# EAGLE design LCD-OLINUXINO-4.3''TS_Rev_D1 (EAGLE 4.16)
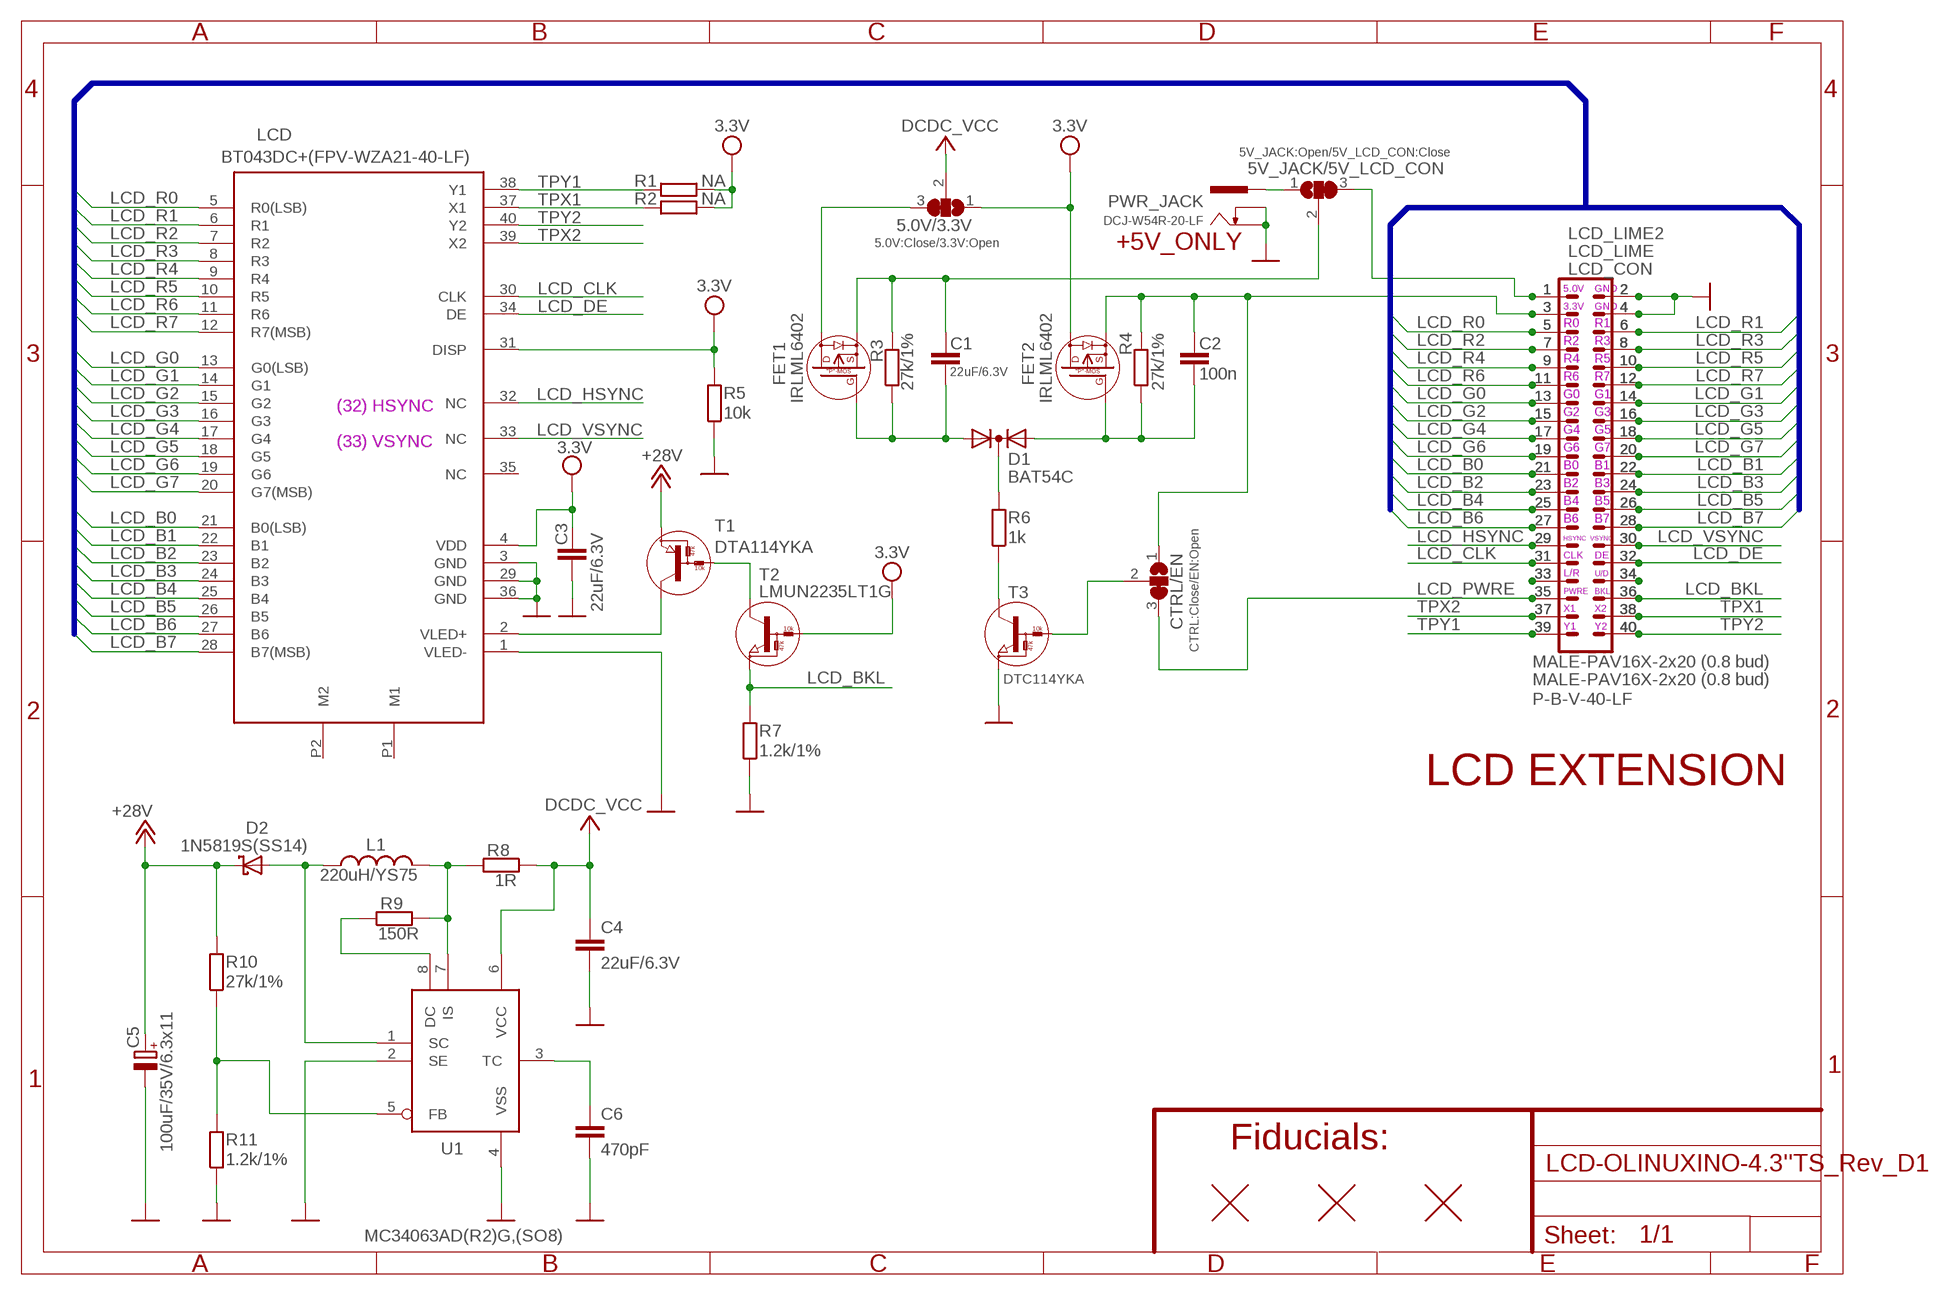
[diagram p0: schematic, sheet 1]

## Parts
5.0V/3.3V  5.0V:Close/3.3V:Open  SJ2W5  [SJ_2_SMALL_23_TIED]
5V_JACK/5V_LCD_CON  5V_JACK:Open/5V_LCD_CON:Close  SJ2W3  [SJ_2_SMALL]
C1  22uF/6.3V  C-EUC0603_DWS  [C0603_DWS]
C2  100n  C-EUC0603_DWS  [C0603_DWS]
C3  22uF/6.3V  C-EUC0603_DWS  [C0603_DWS]
C4  22uF/6.3V  C-EUC0603_DWS  [C0603_DWS]
C5  100uF/35V/6.3x11  CPOL-EUH1M  [CP6.3X11-H-M]
C6  470pF  C-EUC0603_DWS  [C0603_DWS]
CTRL/EN  CTRL:Close/EN:Open  SJ2W5  [SJ_2_SMALL_23_TIED]
D1  BAT54C  DIODE_AC-CA_  [SOT23C]
D2  1N5819S(SS14)  SCHOTKKY7.62SS2  [MLL-41]
FET1  IRLML6402  P-MOS+DIODIRLML6402  [SOT23]
FET2  IRLML6402  P-MOS+DIODIRLML6402  [SOT23]
L1  220uH/YS75  L-USL7078  [L7078]
LCD  BT043DC+(FPV-WZA21-40-LF)  GFT043A13-LCD4.3"  [FPV-WZA21-40-LF]
LCD_CON  P-B-V-40-LF  ML40-GBH-254-SMT-40  [ML40-MALE(GBH-254-SMT-40)]
LCD_LIME  MALE-PAV16X-2x20 (0.8 bud)  ML40YA-V36P-2X20-LF  [YA-V36P-2X20-LF]
LCD_LIME2  MALE-PAV16X-2x20 (0.8 bud)  ML40PA-V16X-2X20-LF_0.90_DRILL  [GPH127SMT-02X20(PA-V16X-2X20-LF)_DRILL_0.9MM]
PWR_JACK  DCJ-W54R-20-LF  PWR-JAKDCJ-W  [PWR-JACK-SMD]
R1  NA  R-EU_R0603_5MIL_DWS  [R0603_5MIL_DWS]
R2  NA  R-EU_R0603_5MIL_DWS  [R0603_5MIL_DWS]
R3  27k/1%  R-EU_R0603_5MIL_DWS  [R0603_5MIL_DWS]
R4  27k/1%  R-EU_R0603_5MIL_DWS  [R0603_5MIL_DWS]
R5  10k  R-EU_R0603_5MIL_DWS  [R0603_5MIL_DWS]
R6  1k  R-EU_R0603_5MIL_DWS  [R0603_5MIL_DWS]
R7  1.2k/1%  R-EU_R0603_5MIL_DWS  [R0603_5MIL_DWS]
R8  1R  R-EU_R0805_5MIL_DWS  [R0805_5MIL_DWS]
R9  150R  R-EU_R0603_5MIL_DWS  [R0603_5MIL_DWS]
R10  27k/1%  R-EU_R0603_5MIL_DWS  [R0603_5MIL_DWS]
R11  1.2k/1%  R-EU_R0603_5MIL_DWS  [R0603_5MIL_DWS]
T1  DTA114YKA  DIGITAL_TRANSISTORS-PNPDTA114YKA  [SOT-23]
T2  LMUN2235LT1G  DIGITAL_TRANSISTORS-NPNDTC114YKA  [SOT-23]
T3  DTC114YKA  DIGITAL_TRANSISTORS-NPNDTC114YKA  [SOT-23]
U1  MC34063AD(R2)G,(SO8)  MC34063A2  [SO-8]
U$1  FIDUCIAL  [FIDUCIAL-1X3]
U$2  FIDUCIAL  [FIDUCIAL-1X3]
U$3  FIDUCIAL  [FIDUCIAL-1X3]

## Nets
3.3VDC [pwr]: C2.1 CTRL/EN.1 FET2.2(S) LCD_CON.3 LCD_LIME2.3 LCD_LIME.3 R4.2
5VDC: 5V_JACK/5V_LCD_CON.2 C1.1 FET1.2(S) R3.2
+5V: 5.0V/3.3V.2 C4.1 R8.1 U1.6(VCC) ; supply symbol labelled DCDC_VCC
+12V: C5.+ D2.K(C) R10.2 T1.2(E) ; supply symbol labelled +28V
GND [pwr]: C3.2 C4.2 C5.- C6.2 LCD.1(VLED-) LCD.3(GND) LCD.29(GND) LCD.36(GND) LCD_CON.2 LCD_CON.4 LCD_LIME2.2 LCD_LIME2.4 LCD_LIME.2 LCD_LIME.4 PWR_JACK.2(-) PWR_JACK.3(--) R5.1 R7.1 R11.1 T3.2(E) U1.2(SE) U1.4(VSS)
LCD_B0: LCD.21(B0(LSB)) LCD_CON.21 LCD_LIME2.21 LCD_LIME.21
LCD_B1: LCD.22(B1) LCD_CON.22 LCD_LIME2.22 LCD_LIME.22
LCD_B2: LCD.23(B2) LCD_CON.23 LCD_LIME2.23 LCD_LIME.23
LCD_B3: LCD.24(B3) LCD_CON.24 LCD_LIME2.24 LCD_LIME.24
LCD_B4: LCD.25(B4) LCD_CON.25 LCD_LIME2.25 LCD_LIME.25
LCD_B5: LCD.26(B5) LCD_CON.26 LCD_LIME2.26 LCD_LIME.26
LCD_B6: LCD.27(B6) LCD_CON.27 LCD_LIME2.27 LCD_LIME.27
LCD_B7: LCD.28(B7(MSB)) LCD_CON.28 LCD_LIME2.28 LCD_LIME.28
LCD_BKL: LCD_CON.36 LCD_LIME2.36 LCD_LIME.36 R7.2 T2.2(E)
LCD_CLK: LCD.30(CLK) LCD_CON.31 LCD_LIME2.31 LCD_LIME.31
LCD_DE: LCD.34(DE) LCD_CON.32 LCD_LIME2.32 LCD_LIME.32
LCD_G0: LCD.13(G0(LSB)) LCD_CON.13 LCD_LIME2.13 LCD_LIME.13
LCD_G1: LCD.14(G1) LCD_CON.14 LCD_LIME2.14 LCD_LIME.14
LCD_G2: LCD.15(G2) LCD_CON.15 LCD_LIME2.15 LCD_LIME.15
LCD_G3: LCD.16(G3) LCD_CON.16 LCD_LIME2.16 LCD_LIME.16
LCD_G4: LCD.17(G4) LCD_CON.17 LCD_LIME2.17 LCD_LIME.17
LCD_G5: LCD.18(G5) LCD_CON.18 LCD_LIME2.18 LCD_LIME.18
LCD_G6: LCD.19(G6) LCD_CON.19 LCD_LIME2.19 LCD_LIME.19
LCD_G7: LCD.20(G7(MSB)) LCD_CON.20 LCD_LIME2.20 LCD_LIME.20
LCD_HSYNC: LCD.32(NC) LCD_CON.29 LCD_LIME2.29 LCD_LIME.29
LCD_PWRE: CTRL/EN.3 LCD_CON.35 LCD_LIME2.35 LCD_LIME.35
LCD_R0: LCD.5(R0(LSB)) LCD_CON.5 LCD_LIME2.5 LCD_LIME.5
LCD_R1: LCD.6(R1) LCD_CON.6 LCD_LIME2.6 LCD_LIME.6
LCD_R2: LCD.7(R2) LCD_CON.7 LCD_LIME2.7 LCD_LIME.7
LCD_R3: LCD.8(R3) LCD_CON.8 LCD_LIME2.8 LCD_LIME.8
LCD_R4: LCD.9(R4) LCD_CON.9 LCD_LIME2.9 LCD_LIME.9
LCD_R5: LCD.10(R5) LCD_CON.10 LCD_LIME2.10 LCD_LIME.10
LCD_R6: LCD.11(R6) LCD_CON.11 LCD_LIME2.11 LCD_LIME.11
LCD_R7: LCD.12(R7(MSB)) LCD_CON.12 LCD_LIME2.12 LCD_LIME.12
LCD_VSYNC: LCD.33(NC) LCD_CON.30 LCD_LIME2.30 LCD_LIME.30
N$1: 5.0V/3.3V.3 FET1.3(D)
N$2: T1.1(B) T2.3(C)
N$4: LCD_CON.33 LCD_LIME2.33 LCD_LIME.33
N$6: LCD_CON.34 LCD_LIME2.34 LCD_LIME.34
N$8: C2.2 D1.1(A1) FET2.1(G) R4.1
N$9: C1.2 D1.2(A2) FET1.1(G) R3.1
N$10: 5V_JACK/5V_LCD_CON.3 LCD_CON.1 LCD_LIME2.1 LCD_LIME.1
N$11: R6.1 T3.3(C)
N$16: CTRL/EN.2 T3.1(B)
N$19: D1.3(K) R6.2
N$22: 5V_JACK/5V_LCD_CON.1 PWR_JACK.1(+)
N$31: R10.1 R11.2 U1.5(FB)
N$64: C6.1 U1.3(TC)
N$65: D2.A L1.1 U1.1(SC)
N$74: L1.2 R8.2 R9.2 U1.7(IS)
N$81: R9.1 U1.8(DC)
TPX1: LCD.37(X1) LCD_CON.38 LCD_LIME2.38 LCD_LIME.38 R2.2
TPX2: LCD.39(X2) LCD_CON.37 LCD_LIME2.37 LCD_LIME.37
TPY1: LCD.38(Y1) LCD_CON.39 LCD_LIME2.39 LCD_LIME.39 R1.2
TPY2: LCD.40(Y2) LCD_CON.40 LCD_LIME2.40 LCD_LIME.40
VCC [pwr]: 5.0V/3.3V.1 C3.1 FET2.3(D) LCD.4(VDD) LCD.31(DISP) R1.1 R2.1 R5.2 T2.1(B) ; supply symbol labelled 3.3V
VLED+: LCD.2(VLED+) T1.3(C)
Unconnected: LCD.35(NC) LCD.P1(M1) LCD.P2(M2)

## Buses
LCD_R[0..7],LCD_G[0..7],LCD_B[0..7]

## Notes on the sheet
- +5V_ONLY
- 5.0V | GND
- 3.3V | GND
- R0 | R1
- R2 | R3
- R4 | R5
- R6 | R7
- G0 | G1
- (32) HSYNC
- G2 | G3
- G4 | G5
- (33) VSYNC
- G6 | G7
- B0 | B1
- B2 | B3
- B4 | B5
- B6 | B7
- HSYNC | VSYNC
- CLK | DE
- L/R | U/D
- PWRE | BKL
- X1 | X2
- Y1 | Y2
- LCD EXTENSION
- Fiducials:

## Library data of the parts
5.0V/3.3V 5V_JACK/5V_LCD_CON CTRL/EN = jumper:SJ2W: SMD solder JUMPER
C1-C4 C6 = rcl:C-EU: CAPACITOR, European symbol
C5 = rcl:CPOL-EU: POLARIZED CAPACITOR, European symbol
D1 = semicon-smd-ipc:DIODE_AC-CA_: DUAL DIODE
D2 = gogo:SCHOTKKY7.62SS
FET1 FET2 = Penko:P-MOS+DIOD
L1 = rcl:L-US: INDUCTOR, American symbol
LCD = olimex_lcd:GFT043: Construction: 4.3 inches a-Si color TFT-LCD, White LED / CCFL Backlight and PCB. Resolution (pixel): 480(R.G.B) X272 Number of the Colors : 262K colors ( R , G , B 6 bit digital each) LCD type : Transmissive Color TFT LCD ( normally White) Interface: 40 pin pitch 0.5 FFC Power Supply Voltage: 3.3V single power input. Built-in power supply circuit. Viewing Direction:6 O`clock (The direction it`s hard to be discolored )
LCD_CON LCD_LIME LCD_LIME2 = con-harting-ml:ML40: HARTING
PWR_JACK = gogo:PWR-JAK
R1-R11 = rcl:R-EU_: RESISTOR, European symbol
T1 = OLIMEX_DISCRET:DIGITAL_TRANSISTORS-PNP: DTA114YKA Digital Transistor - PNP
T2 T3 = OLIMEX_DISCRET:DIGITAL_TRANSISTORS-NPN: DTC114YKA Digital Transistor - NPN
U1 = MPLAB_ICD2:MC34063A
U$1-U$3 = SparkFunEagle-6-6-07:FIDUCIAL: Fiducial Alignment Points Various fiducial points for machine vision alignment.

## Board
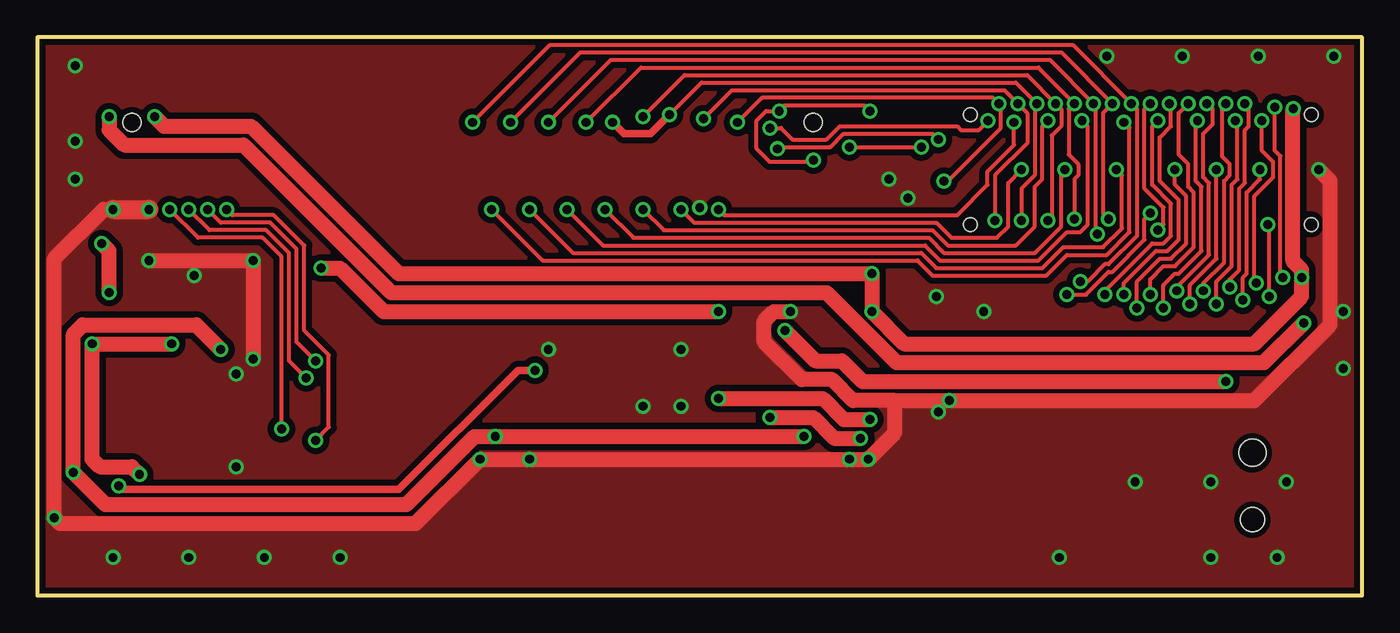
[diagram p1: board, top side]
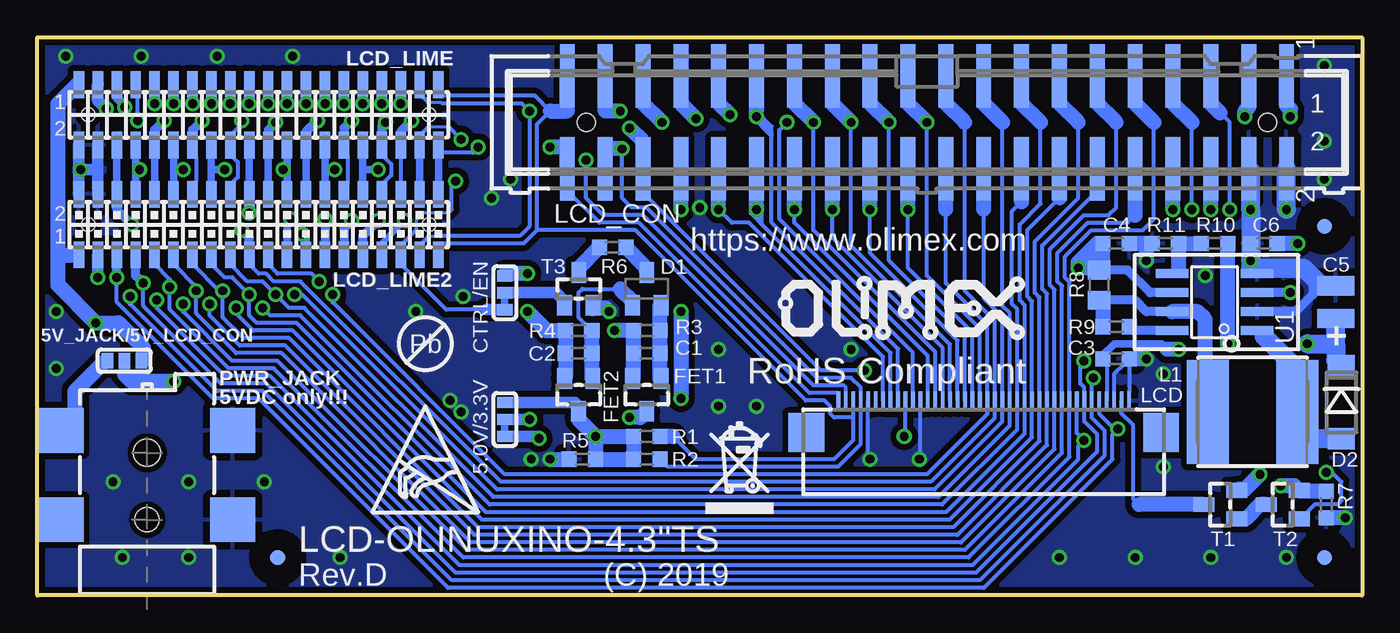
[diagram p2: board, bottom side, seen from below]

Size 88.9 x 37.47 mm. Coordinates in mm from the lower left corner, seen from the top.
Outline: 0,37.47 0,0 88.9,0 88.9,37.47 0,37.47
Copper layers (1*16): Top 0.035mm / dielectric 1.5mm / Bottom 0.035mm
Design rules "default": minimum track width 8mil, minimum drill 0.6mm, track to track 8mil, track to pad 8mil, pad to pad 8mil, via to via 8mil, smd to smd 1mil, copper to edge 10mil, drill to drill 12mil, minimum pad ring 8mil, minimum via ring 8mil, stop-mask expansion 2mil, vias tented up to drill 25mil, thermal gap 20mil

### Footprints (pad centres in the part's own frame; a part is rotated, then mirrored left to right if it is on the bottom)
SJ_2_SMALL_23_TIED = smd 0.762 x 1.016: 1 -1.143,0; 2 0,0; 3 1.143,0
SJ_2_SMALL = smd 0.762 x 1.016: 1 -1.143,0; 2 0,0; 3 1.143,0
C0603_DWS = smd 1.016 x 1.016: 1 -0.889,0; 2 0.889,0
CP6.3X11-H-M = smd 2.5 x 1.3: + 0,-1.1; - 0,1.1
SOT23C = smd 1.4 x 1: 1 1.1,-0.95; 2 1.1,0.95; 3 -1.1,0
MLL-41 = smd 1.45 x 1.8: A 2.445,0; K -2.445,0
SOT23 = smd 1.4 x 1: 1 1.1,-0.95; 2 1.1,0.95; 3 -1.1,0
L7078 = smd 2.8 x 7: 1 -3,0; 2 3,0
FPV-WZA21-40-LF = smd 0.25 x 1.3: 1 -9.8,-0.85; 2 -9.3,-0.85; 3 -8.8,-0.85; 4 -8.3,-0.85; 5 -7.8,-0.85; 6 -7.3,-0.85; 7 -6.8,-0.85; 8 -6.3,-0.85; 9 -5.8,-0.85; 10 -5.3,-0.85; 11 -4.8,-0.85; 12 -4.3,-0.85; 13 -3.8,-0.85; 14 -3.3,-0.85; 15 -2.8,-0.85; 16 -2.3,-0.85; 17 -1.8,-0.85; 18 -1.3,-0.85; 19 -0.8,-0.85; 20 -0.3,-0.85; 21 0.2,-0.85; 22 0.7,-0.85; 23 1.2,-0.85; 24 1.7,-0.85; 25 2.2,-0.85; 26 2.7,-0.85; 27 3.2,-0.85; 28 3.7,-0.85; 29 4.2,-0.85; 30 4.7,-0.85; 31 5.2,-0.85; 32 5.7,-0.85; 33 6.2,-0.85; 34 6.7,-0.85; 35 7.2,-0.85; 36 7.7,-0.85; 37 8.2,-0.85; 38 8.7,-0.85; 39 9.2,-0.85; 40 9.7,-0.85 | smd 2.4 x 2.6: P1 -11.95,1.25; P2 11.85,1.25
ML40-MALE(GBH-254-SMT-40) = smd 1 x 4.25: 1 -24.13,-3.125; 2 -24.13,3.125; 3 -21.59,-3.125; 4 -21.59,3.125; 5 -19.05,-3.125; 6 -19.05,3.125; 7 -16.51,-3.125; 8 -16.51,3.125; 9 -13.97,-3.125; 10 -13.97,3.125; 11 -11.43,-3.125; 12 -11.43,3.125; 13 -8.89,-3.125; 14 -8.89,3.125; 15 -6.35,-3.125; 16 -6.35,3.125; 17 -3.81,-3.125; 18 -3.81,3.125; 19 -1.27,-3.125; 20 -1.27,3.125; 21 1.27,-3.125; 22 1.27,3.125; 23 3.81,-3.125; 24 3.81,3.125; 25 6.35,-3.125; 26 6.35,3.125; 27 8.89,-3.125; 28 8.89,3.125; 29 11.43,-3.125; 30 11.43,3.125; 31 13.97,-3.125; 32 13.97,3.125; 33 16.51,-3.125; 34 16.51,3.125; 35 19.05,-3.125; 36 19.05,3.125; 37 21.59,-3.125; 38 21.59,3.125; 39 24.13,-3.125; 40 24.13,3.125 | hole 1.2: -22.86,0; 22.86,0
YA-V36P-2X20-LF_0.9DRILL = smd 0.7 x 1.8: 1 -12.065,2.032; 2 -12.065,-2.032; 3 -10.795,2.032; 4 -10.795,-2.032; 5 -9.525,2.032; 6 -9.525,-2.032; 7 -8.255,2.032; 8 -8.255,-2.032; 9 -6.985,2.032; 10 -6.985,-2.032; 11 -5.715,2.032; 12 -5.715,-2.032; 13 -4.445,2.032; 14 -4.445,-2.032; 15 -3.175,2.032; 16 -3.175,-2.032; 17 -1.905,2.032; 18 -1.905,-2.032; 19 -0.635,2.032; 20 -0.635,-2.032; 21 0.635,2.032; 22 0.635,-2.032; 23 1.905,2.032; 24 1.905,-2.032; 25 3.175,2.032; 26 3.175,-2.032; 27 4.445,2.032; 28 4.445,-2.032; 29 5.715,2.032; 30 5.715,-2.032; 31 6.985,2.032; 32 6.985,-2.032; 33 8.255,2.032; 34 8.255,-2.032; 35 9.525,2.032; 36 9.525,-2.032; 37 10.795,2.032; 38 10.795,-2.032; 39 12.065,2.032; 40 12.065,-2.032 | hole 0.9: -11.43,0; 11.43,0
GPH127SMT-02X20(PA-V16X-2X20-LF)_DRILL_0.9MM = smd 0.7 x 1.8: 1 -12.065,-2.032; 2 -12.065,2.032; 3 -10.795,-2.032; 4 -10.795,2.032; 5 -9.525,-2.032; 6 -9.525,2.032; 7 -8.255,-2.032; 8 -8.255,2.032; 9 -6.985,-2.032; 10 -6.985,2.032; 11 -5.715,-2.032; 12 -5.715,2.032; 13 -4.445,-2.032; 14 -4.445,2.032; 15 -3.175,-2.032; 16 -3.175,2.032; 17 -1.905,-2.032; 18 -1.905,2.032; 19 -0.635,-2.032; 20 -0.635,2.032; 21 0.635,-2.032; 22 0.635,2.032; 23 1.905,-2.032; 24 1.905,2.032; 25 3.175,-2.032; 26 3.175,2.032; 27 4.445,-2.032; 28 4.445,2.032; 29 5.715,-2.032; 30 5.715,2.032; 31 6.985,-2.032; 32 6.985,2.032; 33 8.255,-2.032; 34 8.255,2.032; 35 9.525,-2.032; 36 9.525,2.032; 37 10.795,-2.032; 38 10.795,2.032; 39 12.065,-2.032; 40 12.065,2.032 | hole 0.9: -11.43,0; 11.43,0
PWR-JACK-SMD = smd 3 x 3: 1 6,5.75; 2 0,-5.75; 3 6,-5.75; 4 0,5.75 | hole 1.6: 0,0 | hole 1.8: 4.5,0
R0603_5MIL_DWS = smd 1.016 x 1.016: 1 -0.889,0; 2 0.889,0
R0805_5MIL_DWS = smd 1.27 x 1.524: 1 -1.016,0; 2 1.016,0
SOT-23 = smd 1.4 x 1: 1 1.1,-0.95; 2 1.1,0.95; 3 -1.1,0
SO-8 = smd 0.6 x 2.2: 1 -1.905,-2.854; 2 -0.635,-2.854; 3 0.635,-2.854; 4 1.905,-2.854; 5 1.905,2.854; 6 0.635,2.854; 7 -0.635,2.854; 8 -1.905,2.854
FIDUCIAL-1X3 = smd 1 x 1: 1 0,0

### Placement (x,y rotation side)
5.0V/3.3V  57.53,11.81 270 bottom
5V_JACK/5V_LCD_CON  83.06,15.75 0 bottom
C1  48.01,16.26 0 bottom
C2  52.58,16.26 0 bottom
C3  16.51,15.88 0 bottom
C4  16.51,23.62 0 bottom
C5  1.78,19.68 0 bottom
C6  6.6,23.62 180 bottom
CTRL/EN  57.53,20.32 270 bottom
D1  48.01,20.57 270 bottom
D2  1.4,12.95 270 bottom
FET1  48.01,13.46 90 bottom
FET2  52.58,13.46 90 bottom
L1  7.37,12.32 180 bottom
LCD  25.45,12.19 180 bottom
LCD_CON  29.21,31.75 180 bottom
LCD_LIME  MALE-PAV16X-2x20 (0.8 bud)  [YA-V36P-2X20-LF_0.9DRILL]  74.04,32.26 0 bottom
LCD_LIME2  74.04,24.89 0 bottom
PWR_JACK  81.53,5.08 90 bottom
R1  48.01,10.67 0 bottom
R2  48.01,9.14 0 bottom
R3  48.01,17.78 180 bottom
R4  52.58,17.78 180 bottom
R5  52.32,9.14 0 bottom
R6  50.29,23.37 0 bottom
R7  2.41,6.1 90 bottom
R8  17.65,20.83 270 bottom
R9  16.51,18.03 180 bottom
R10  9.91,23.62 0 bottom
R11  13.21,23.62 0 bottom
T1  9.53,6.1 0 bottom
T2  5.33,6.1 0 bottom
T3  52.56,20.57 270 bottom
U1  9.91,19.68 90 bottom
U$1  72.77,2.54 270 bottom
U$2  2.54,24.77 270 bottom
U$3  2.54,2.54 270 bottom
U$4  [PB_SMALL]  62.87,16.89 0 bottom
U$8  [OLIMEX1_V]  21.46,17.02 0 bottom
U$10  [ESD_SYMBOL]  66.42,5.59 0 bottom
U$11  [RECYCLE_BIN1/8]  44.07,5.46 0 bottom

### Tracks (layer width: path | path; a pad name or v marks a point on that pad's centre or on a via)
3.3VDC  (via drill 0.6)
  Top 0.813: 84.25,32.64 v84.28,32.66
  Top 1.016: v7.87,32.13 8.51,31.5 14.35,31.5 24.26,21.59 v56.01,21.59 v56.01,19.05 58.17,16.89 81.66,16.89 84.84,20.07 v84.84,21.34 84.84,21.84 84.25,22.43 84.25,32.64
  Bottom 0.762: 57.53,21.59 CTRL/EN.1 | v84.84,21.34 LCD_LIME2.3
  Bottom 0.813: v84.28,32.66 84.84,33.22 LCD_LIME.3
  Bottom 1.016: FET2.2 53.47,14.62 C2.1 R4.2 54.74,17.78 v56.01,19.05 | v56.01,21.59 57.53,21.59 | 7.62,35.56 LCD_CON.3 7.62,32.77 7.87,32.51 v7.87,32.13
5VDC  (via drill 0.6)
  Top 1.016: v50.16,17.78 52.2,15.75 53.98,15.75 55.37,14.35 v79.76,14.35
  Bottom 0.762: 83.06,14.86 5V_JACK/5V_LCD_CON.2
  Bottom 1.016: FET1.2 48.9,14.56 C1.1 R3.2 v50.16,17.78 | v79.76,14.35 82.55,14.35 83.06,14.86
+5V  (via drill 0.6)
  Top 1.016: v19.05,21.97 20.32,21.97 23.24,19.05 v45.72,19.05 | v45.72,13.21 52.7,13.21 54.1,11.81 v55.88,11.81
  Bottom 0.61: U1.6 14.22,20.32 15.75,21.84 17.4,21.84
  Bottom 0.762: v55.88,11.81 5.0V/3.3V.2
  Bottom 1.016: 17.4,21.84 R8.1 | 17.4,21.84 C4.1 17.78,23.62 19.05,22.35 v19.05,21.97 | 17.4,21.84 17.4,21.97 v19.05,21.97 | v45.72,19.05 v45.72,13.21 | v19.05,21.97 17.78,23.24
+12V  (via drill 0.6)
  Top 1.016: v6.86,8.13 6.35,8.64 4.19,8.64 3.68,9.14 v3.68,16.89 v9.02,16.89
  Bottom 1.016: v9.02,16.89 R10.2 | T1.2 8.43,7.07 8.38,7.11 7.87,7.11 v6.86,8.13
  Bottom 1.27: D2.K 1.78,15.78 1.78,16.89 | v3.68,16.89 1.78,16.89 | 1.78,16.89 C5.+
GND  (via drill 0.6)
  Top 1.016: v7.49,22.48 v14.48,22.48 v14.48,15.88 | v5.08,25.91 4.45,25.91 1.14,22.61 v1.14,5.21 1.52,4.83 25.4,4.83 v29.72,9.14 v33.02,9.14 v54.48,9.14 v55.75,9.14 57.53,10.92 57.53,13.08 | v50.55,19.05 49.4,19.05 48.77,18.41 48.77,17.02 51.31,14.48 53.34,14.48 54.74,13.08 57.53,13.08 | 57.53,13.08 81.66,13.08 86.74,18.16 86.74,27.81 v85.98,28.57
  Top 1.27: v5.08,25.91 v7.49,25.91
  Bottom 0.254: 15.62,15.49 15.62,13.72 15.65,13.69 LCD.1 | C3.2 15.62,15.49 | 15.62,15.49 16,15.49 16.65,14.85 LCD.3 | v29.72,9.14 29.65,9.21 LCD.29 | v33.02,9.14 33.15,9.27 LCD.36
  Bottom 0.508: 7.05,21.97 U1.4
  Bottom 0.61: U1.2 4.45,19.05 3.3,20.19 3.3,20.95 2.92,20.95
  Bottom 0.762: 7.49,28.5 LCD_CON.4 | 84.84,28.57 LCD_LIME2.4 | 84.84,28.57 LCD_LIME.4 | 86.11,28.57 LCD_LIME2.2 | 86.11,28.57 v85.98,28.57 84.84,28.57 | 86.11,28.57 LCD_LIME.2
  Bottom 1.016: 14.48,23.62 R11.1 | 14.48,23.62 C4.2 | v1.14,5.21 R7.1 | v54.48,9.14 R5.1 | v14.48,22.48 14.48,23.62 | v14.48,15.88 C3.2 | v50.55,19.05 50.8,19.3 51.61,19.3 T3.2
  Bottom 1.27: C5.- 2.75,20.79 2.92,20.95 3.94,21.97 7.05,21.97 7.49,21.97 v7.49,22.48 C6.2 v7.49,25.91 7.49,28.5 | v5.08,25.91 LCD_CON.2
  other vias: 5.08,2.54 10.16,2.54 15.24,2.54 20.32,2.54 68.58,2.54 78.74,2.54 83.19,2.54 83.82,7.62 78.74,7.62 73.66,7.62 2.54,35.56 2.54,30.48 87,36.2 81.92,36.2 76.83,36.2 71.75,36.2 63.5,19.05 57.15,27.94 58.42,26.67 2.54,27.94 13.34,8.64 13.34,14.86 40.64,12.7 43.18,12.7 43.18,16.51 34.29,16.51 44.45,26.04 60.33,20.07 10.54,21.46 87.63,15.24 87.63,19.05 61.21,13.08 60.45,12.32
  pour Top (isolate 0.406, rank 2): -5.08,42.55 -5.08,-5.08 93.98,-5.08 93.98,42.55
  pour Bottom (isolate 0.406, rank 3): -2.54,-2.54 91.44,-2.54 91.44,40.01 -2.54,40.01
LCD_B0  (via drill 0.6)
  Top 0.254: v29.21,31.75 34.42,36.96 69.47,36.96 v73.41,33.02 73.79,32.64 73.79,24.13 71.88,22.23 71.63,22.23 70.48,21.08 v69.98,21.08
  Bottom 0.254: LCD.21 25.65,17.9 29.21,21.46 v29.21,31.75 | LCD_LIME2.21 73.41,22.23 72.77,21.59 70.48,21.59 v69.98,21.08
  Bottom 0.406: v73.41,33.02 LCD_LIME.21
  Bottom 1.016: LCD_CON.21 30.48,33.02 v29.21,31.75
LCD_B1  (via drill 0.6)
  Top 0.254: v30.48,25.91 33.91,22.48 59.05,22.48 60.07,21.46 67.69,21.46 69.09,22.86 71.75,22.86 73.28,24.38 73.28,31.37 v72.9,31.75
  Bottom 0.254: LCD.22 26.15,17.64 30.48,21.97 v30.48,25.91
  Bottom 0.508: LCD_LIME.22 LCD_LIME2.22
  Bottom 0.61: LCD_LIME.22 73.41,31.24 v72.9,31.75
  Bottom 1.016: v30.48,25.91 LCD_CON.22
LCD_B2  (via drill 0.6)
  Top 0.254: v31.75,31.75 36.45,36.45 68.71,36.45 v72.14,33.02 71.5,32.38 71.5,25.65 v71.88,25.27
  Bottom 0.254: LCD.23 26.65,17.38 31.75,22.48 v31.75,31.75
  Bottom 0.406: v72.14,33.02 LCD_LIME.23
  Bottom 0.508: LCD_LIME2.23 72.14,25.02 v71.88,25.27
  Bottom 1.016: LCD_CON.23 33.02,33.02 v31.75,31.75
LCD_B3  (via drill 0.6)
  Top 0.254: v33.02,25.91 35.94,22.99 59.31,22.99 60.33,21.97 67.44,21.97 68.83,23.37 71.5,23.37 72.77,24.64 72.77,28.19 v72.39,28.57
  Bottom 0.254: LCD.24 27.15,17.12 33.02,22.99 v33.02,25.91 | v72.39,28.57 72.14,28.57
  Bottom 0.508: LCD_LIME.24 72.14,28.57 LCD_LIME2.24
  Bottom 1.016: v33.02,25.91 LCD_CON.24
LCD_B4  (via drill 0.6)
  Top 0.254: v34.29,31.75 38.48,35.94 67.94,35.94 v70.87,33.02 70.99,32.89 70.99,24.38 v71.12,24.26
  Bottom 0.254: LCD.25 27.65,16.85 34.29,23.5 v34.29,31.75
  Bottom 0.406: v70.87,33.02 LCD_LIME.25
  Bottom 0.508: v71.12,24.26 70.87,24 LCD_LIME2.25
  Bottom 1.016: LCD_CON.25 35.56,33.02 v34.29,31.75
LCD_B5  (via drill 0.6)
  Top 0.254: v35.56,25.91 37.97,23.5 59.56,23.5 60.58,22.48 67.18,22.48 69.09,24.38 69.98,24.38 70.48,24.89 70.48,31.5 v70.1,31.88
  Bottom 0.254: LCD.26 28.15,16.59 35.56,24 v35.56,25.91
  Bottom 0.508: LCD_LIME.26 LCD_LIME2.26
  Bottom 0.61: v70.1,31.88 70.87,31.11 LCD_LIME.26
  Bottom 1.016: 35.56,28.7 LCD_CON.26 v35.56,25.91
LCD_B6  (via drill 0.6)
  Top 0.254: v36.83,31.75 40.51,35.43 67.18,35.43 v69.6,33.02 69.22,32.64 69.22,29.59 69.85,28.96 69.85,28.19 69.6,27.94 v69.6,25.27
  Bottom 0.254: LCD.27 28.65,16.33 36.83,24.51 v36.83,31.75
  Bottom 0.406: v69.6,33.02 LCD_LIME.27
  Bottom 0.61: v69.6,25.27 LCD_LIME2.27
  Bottom 1.016: LCD_CON.27 38.1,33.02 v36.83,31.75
LCD_B7  (via drill 0.6)
  Top 0.254: v38.1,25.91 40.01,24 59.82,24 60.83,22.99 66.93,22.99 68.71,24.77 68.71,28.32 v68.96,28.57
  Bottom 0.254: LCD.28 29.15,16.07 38.1,25.02 v38.1,25.91 | 69.47,28.57 69.6,28.57
  Bottom 0.508: LCD_LIME.28 69.6,28.57 LCD_LIME2.28 | v68.96,28.57 69.47,28.57
  Bottom 1.016: 38.1,28.7 LCD_CON.28 v38.1,25.91
LCD_BKL  (via drill 0.6)
  Top 0.254: v49.15,31.37 49.91,31.37 50.67,30.61 52.96,30.61 53.85,31.5 61.72,31.5 61.98,31.24 63.17,31.24 v63.78,31.85
  Top 0.508: v5.46,7.37 5.71,7.11 24.26,7.11 32.26,15.11 v33.4,15.11
  Bottom 0.254: v33.4,15.11 36.32,15.11 48.26,27.05 LCD_CON.36 | LCD_LIME.36 LCD_LIME2.36
  Bottom 0.61: LCD_LIME.36 64.52,31.11 v63.78,31.85
  Bottom 1.016: R7.2 4.17,6.99 T2.2 4.55,7.37 v5.46,7.37 | LCD_CON.36 48.26,30.48 v49.15,31.37
LCD_CLK  (via drill 0.6)
  Top 0.254: v42.42,32.26 44.58,34.42 65.66,34.42 v67.06,33.02 66.93,32.89 66.93,28.19 66.04,27.3 v66.04,25.15
  Top 0.508: v42.42,32.26 41.15,30.99 40.64,30.99 39.37,30.99 v38.61,31.75
  Bottom 0.254: LCD.30 30.15,16.31 39.12,25.27 39.12,31.24 v38.61,31.75
  Bottom 0.406: v67.06,33.02 LCD_LIME.31
  Bottom 0.61: v66.04,25.15 67.06,24.13 LCD_LIME2.31
  Bottom 1.016: LCD_CON.31 43.18,33.02 v42.42,32.26
LCD_DE  (via drill 0.6)
  Top 0.254: v43.18,25.91 44.07,25.02 60.33,25.02 61.34,24 64.39,24 65.15,24.77 65.15,27.69 v66.04,28.57
  Bottom 0.254: LCD.34 32.15,16.02 41.15,25.02 42.29,25.02 v43.18,25.91
  Bottom 0.508: 67.06,28.57 LCD_LIME2.32 | 67.06,28.57 LCD_LIME.32 | v66.04,28.57 67.06,28.57
  Bottom 1.016: v43.18,25.91 LCD_CON.32
LCD_G0  (via drill 0.6)
  Top 0.254: v76.45,20.45 76.45,20.7 78.61,22.86 78.61,27.69 78.23,28.07 78.23,30.99 78.87,31.62 78.87,32.64 v78.49,33.02
  Bottom 0.254: 19.05,31.75 19.05,26.67 21.97,23.75 21.97,20.32 21.65,20 LCD.13 21.65,10.36 27.43,4.57 59.31,4.57 72.01,17.27 75.06,17.27 76.45,18.67 v76.45,20.45 76.71,20.45 78.49,22.23 LCD_LIME2.13
  Bottom 0.406: v78.49,33.02 LCD_LIME.13
  Bottom 1.016: LCD_CON.13 20.32,33.02 19.05,31.75
LCD_G1  (via drill 0.6)
  Top 0.254: v75.56,19.3 75.56,20.83 76.33,21.59 76.58,21.59 78.11,23.11 78.11,27.43 77.72,27.81 77.72,31.75 v77.85,31.88
  Bottom 0.254: 20.32,26.67 22.48,24.51 22.48,20.07 22.15,19.74 LCD.14 22.15,10.62 27.69,5.08 59.05,5.08 71.75,17.78 74.42,17.78 75.56,18.92 v75.56,19.3 | LCD_LIME.14 78.49,29.59 78.23,29.34 78.23,27.81 78.49,27.56 LCD_LIME2.14
  Bottom 0.61: v77.85,31.88 78.49,31.24 LCD_LIME.14
  Bottom 1.016: 20.32,26.67 LCD_CON.14
LCD_G2  (via drill 0.6)
  Top 0.254: v74.68,20.19 74.68,21.21 75.56,22.1 76.33,22.1 77.6,23.37 77.6,27.05 77.22,27.43 77.22,28.96 76.58,29.59 76.58,32.38 v77.22,33.02
  Bottom 0.254: 21.59,31.75 21.59,26.29 22.99,24.89 22.99,19.81 22.65,19.47 LCD.15 22.65,10.88 27.94,5.59 58.8,5.59 71.5,18.29 74.17,18.29 74.68,18.8 v74.68,20.19 75.82,21.34 76.33,21.34 77.22,22.23 LCD_LIME2.15
  Bottom 0.406: v77.22,33.02 LCD_LIME.15
  Bottom 1.016: LCD_CON.15 22.86,33.02 21.59,31.75
LCD_G3  (via drill 0.6)
  Top 0.254: v73.79,19.3 73.79,21.08 75.31,22.61 76.07,22.61 77.09,23.62 77.09,26.8 76.33,27.56 v76.33,28.57
  Bottom 0.254: 22.86,26.42 23.5,25.78 23.5,19.56 23.15,19.21 LCD.16 23.15,11.14 28.19,6.1 58.55,6.1 71.25,18.8 73.28,18.8 v73.79,19.3
  Bottom 0.508: 77.22,28.57 LCD_LIME2.16 | 77.22,28.57 LCD_LIME.16 | v76.33,28.57 77.22,28.57
  Bottom 1.016: 22.86,26.42 LCD_CON.16
LCD_G4  (via drill 0.6)
  Top 0.254: v72.9,20.19 72.9,20.95 75.06,23.11 75.82,23.11 76.58,23.88 76.58,26.54 75.31,27.81 75.31,30.73 76.07,31.5 76.07,32.89 v75.95,33.02
  Bottom 0.254: 24.13,31.75 24.13,19.43 23.65,18.95 LCD.17 23.65,11.4 28.45,6.6 58.29,6.6 70.99,19.3 72.01,19.3 v72.9,20.19 73.79,21.08 74.8,21.08 75.95,22.23 LCD_LIME2.17
  Bottom 0.406: v75.95,33.02 LCD_LIME.17
  Bottom 1.016: 24.13,31.75 25.4,33.02 LCD_CON.17
LCD_G5  (via drill 0.6)
  Top 0.254: v71.63,20.19 71.63,20.45 74.8,23.62 75.56,23.62 76.07,24.13 76.07,26.29 74.8,27.56 74.8,31.5 v75.18,31.88
  Bottom 0.254: 25.4,25.91 25.4,19.94 24.15,18.69 LCD.18 24.15,11.66 28.7,7.11 58.04,7.11 71.12,20.19 v71.63,20.19 | LCD_LIME2.18 75.95,27.56 75.44,28.07 75.44,29.08 75.95,29.59 LCD_LIME.18 75.95,30.86 75.18,31.62 v75.18,31.88
  Bottom 1.016: 25.4,25.91 LCD_CON.18
LCD_G6  (via drill 0.6)
  Top 0.254: v75.18,24.51 75.56,24.89 75.56,26.04 74.3,27.3 74.3,32.64 v74.68,33.02
  Bottom 0.254: 26.67,31.75 26.67,20.45 24.65,18.43 LCD.19 24.65,11.93 28.96,7.62 57.78,7.62 71.25,21.08 73.03,21.08 73.53,21.59 74.04,21.59 74.68,22.23 LCD_LIME2.19
  Bottom 0.406: v74.68,33.02 LCD_LIME.19
  Bottom 0.61: LCD_LIME2.19 74.68,24 v75.18,24.51
  Bottom 1.016: LCD_CON.19 27.94,33.02 26.67,31.75
LCD_G7  (via drill 0.6)
  Top 0.254: v69.09,20.19 70.36,20.19 71.88,21.72 72.14,21.72 74.3,23.88 74.3,25.27 v74.68,25.65
  Bottom 0.254: 27.94,25.91 27.94,20.95 25.15,18.16 LCD.20 25.15,12.19 29.21,8.13 57.53,8.13 69.09,19.68 v69.09,20.19
  Bottom 0.508: LCD_LIME2.20 LCD_LIME.20
  Bottom 0.61: v74.68,25.65 LCD_LIME2.20
  Bottom 1.016: 27.94,25.91 LCD_CON.20
LCD_HSYNC  (via drill 0.6)
  Top 0.254: v40.64,32.13 43.43,34.92 66.42,34.92 v68.33,33.02 68.71,32.64 68.71,31.5 68.07,30.86 68.07,25.4 v67.82,25.15
  Bottom 0.254: LCD.32 31.15,16.54 39.62,25.02 39.62,30.84 | 39.62,30.84 39.62,30.96 | 39.62,30.96 39.62,31.11 | 39.62,31.11 39.62,31.47 40.64,32.49 40.64,32.61 | 39.62,31.11 v40.64,32.13 | 39.62,30.96 40.64,31.98 40.64,32.11 | 39.62,30.84 40.89,32.11
  Bottom 0.406: v68.33,33.02 LCD_LIME.29
  Bottom 0.61: v67.82,25.15 68.33,24.64 LCD_LIME2.29
  Bottom 1.016: v40.64,32.13 40.64,32.61 LCD_CON.29
LCD_PWRE  (via drill 0.6)
  Top 0.254: v46.99,31.75 48.64,33.4 64.14,33.4 v64.52,33.02 64.64,32.89 64.64,31.37 61.09,27.81 v60.83,27.81
  Bottom 0.203: 63.45,24.56 63.45,25.2 62.94,25.7 61.29,25.7
  Bottom 0.254: 58.8,19.18 61.47,19.18 64.52,22.23 LCD_LIME2.35 64.52,23.5 63.45,24.56 | 61.29,25.7 61.09,25.91 61.09,27.56 v60.83,27.81
  Bottom 0.406: v64.52,33.02 LCD_LIME.35
  Bottom 0.762: CTRL/EN.3 58.8,19.18
  Bottom 1.016: LCD_CON.35 48.26,33.02 v46.99,31.75
LCD_R0  (via drill 0.6)
  Top 0.254: v8.89,25.91 10.79,24 15.11,24 16.38,22.73 v16.38,11.18 | v83.57,21.34 83.41,21.49 83.41,29.49 83.03,29.87 v83.03,32.77
  Bottom 0.254: v8.89,25.91 8.89,31.75 9.53,32.38 | LCD.5 17.65,12.19 16.64,11.18 v16.38,11.18 16.76,10.79 16.76,9.14 25.4,0.51 61.34,0.51 74.04,13.21 77.09,13.21 83.57,19.68 v83.57,21.34
  Bottom 0.61: v83.57,21.34 LCD_LIME2.5 | v83.03,32.77 83.03,32.87 83.57,33.4 LCD_LIME.5
  Bottom 1.016: LCD_CON.5 10.16,33.02 9.53,32.38
LCD_R1  (via drill 0.6)
  Top 0.254: v10.16,25.91 11.56,24.51 15.37,24.51 16.89,22.99 16.89,15.75 v18.03,14.61 | v82.68,20.07 82.68,24.77 v82.55,24.89
  Bottom 0.254: v18.03,14.61 18.15,14.49 LCD.6 18.15,11.93 17.27,11.05 17.27,9.4 25.65,1.02 61.09,1.02 73.79,13.72 76.83,13.72 82.68,19.56 v82.68,20.07
  Bottom 0.508: LCD_LIME2.6 LCD_LIME.6
  Bottom 0.61: v82.55,24.89 83.57,25.91 LCD_LIME2.6
  Bottom 1.016: v10.16,25.91 LCD_CON.6
LCD_R2  (via drill 0.6)
  Top 0.254: v18.67,15.75 17.4,17.02 17.4,23.24 15.62,25.02 12.32,25.02 v11.43,25.91 | v81.79,20.95 81.66,21.08 81.66,26.8 82.93,28.07 82.93,29.08 82.17,29.84 v82.17,31.88
  Bottom 0.254: v11.43,25.91 11.43,31.75 | v18.67,15.75 18.92,15.49 18.92,14.22 18.65,13.95 LCD.7 18.65,11.66 17.78,10.79 17.78,9.65 25.91,1.52 60.83,1.52 73.53,14.22 76.58,14.22 81.79,19.43 v81.79,20.95 | v82.17,31.88 82.17,34.16 LCD_LIME.7
  Bottom 0.61: v81.79,20.95 82.3,21.46 LCD_LIME2.7
  Bottom 1.016: 11.43,31.75 12.7,33.02 LCD_CON.7
LCD_R3  (via drill 0.6)
  Top 0.254: v18.67,10.41 19.56,11.3 19.56,16.13 17.91,17.78 17.91,23.5 15.88,25.53 13.08,25.53 v12.7,25.91 | v80.9,19.81 80.9,21.34 81.15,21.59 81.15,27.05 82.04,27.94 v82.04,28.57
  Bottom 0.254: LCD.8 19.15,10.89 v18.67,10.41 19.05,10.03 19.05,9.14 26.16,2.03 60.58,2.03 73.28,14.73 76.33,14.73 80.9,19.3 v80.9,19.81 | v82.04,28.57 82.3,28.57
  Bottom 0.508: LCD_LIME2.8 82.3,28.57 LCD_LIME.8
  Bottom 1.016: v12.7,25.91 LCD_CON.8
LCD_R4  (via drill 0.6)
  Top 0.254: v80.01,20.7 80.01,21.21 80.64,21.84 80.64,27.3 81.03,27.69 81.03,31.24 81.28,31.5 81.28,32.77 v81.03,33.02
  Bottom 0.254: 13.97,31.75 13.97,25.27 14.73,24.51 18.16,24.51 19.94,22.73 19.94,21.34 19.65,21.05 LCD.9 19.65,9.31 26.42,2.54 60.33,2.54 73.03,15.24 76.07,15.24 80.01,19.18 v80.01,20.7 80.01,21.21 81.03,22.23 LCD_LIME2.9
  Bottom 0.406: v81.03,33.02 LCD_LIME.9
  Bottom 1.016: 13.97,31.75 15.24,33.02 LCD_CON.9
LCD_R5  (via drill 0.6)
  Top 0.254: v79.12,19.56 79.12,21.08 80.14,22.1 80.14,27.56 80.52,27.94 80.52,31.75 v80.39,31.88
  Bottom 0.254: 15.24,25.53 15.75,25.02 18.41,25.02 20.45,22.99 20.45,21.08 20.15,20.78 LCD.10 20.15,9.57 26.67,3.05 60.07,3.05 72.77,15.75 75.82,15.75 79.12,19.05 v79.12,19.56
  Bottom 0.508: LCD_LIME.10 LCD_LIME2.10
  Bottom 0.61: v80.39,31.88 81.03,31.24 LCD_LIME.10
  Bottom 1.016: 15.24,25.53 LCD_CON.10
LCD_R6  (via drill 0.6)
  Top 0.254: v78.23,20.45 78.23,20.95 79.63,22.35 79.63,27.81 80.01,28.19 80.01,28.96 79.5,29.46 79.5,32.77 v79.76,33.02
  Bottom 0.254: 16.51,31.75 16.51,26.04 17.02,25.53 18.67,25.53 20.95,23.24 20.95,20.83 20.65,20.52 LCD.11 20.65,9.83 26.92,3.56 59.82,3.56 72.52,16.26 75.56,16.26 78.23,18.92 v78.23,20.45 78.23,20.7 79.76,22.23 LCD_LIME2.11 | LCD_CON.11 17.78,34.92
  Bottom 0.406: v79.76,33.02 LCD_LIME.11
  Bottom 1.016: 16.51,31.75 17.78,33.02 LCD_CON.11
LCD_R7  (via drill 0.6)
  Top 0.254: v77.34,19.56 77.34,20.83 79.12,22.61 v79.12,28.57
  Bottom 0.254: LCD_CON.12 17.78,27.18 21.46,23.5 21.46,20.57 21.15,20.26 LCD.12 21.15,10.09 27.18,4.06 59.56,4.06 72.26,16.76 75.31,16.76 77.34,18.8 v77.34,19.56 | 79.63,28.57 79.76,28.57
  Bottom 0.508: LCD_LIME2.12 79.76,28.57 LCD_LIME.12 | v79.12,28.57 79.63,28.57
LCD_VSYNC  (via drill 0.6)
  Top 0.254: v40.64,25.91 42.04,24.51 60.07,24.51 61.09,23.5 65.66,23.5 66.93,24.77 66.93,27.43 67.44,27.94 67.44,31.5 v67.82,31.88
  Bottom 0.254: LCD_LIME.30 68.33,29.72 68.07,29.46 68.07,27.69 68.33,27.43 LCD_LIME2.30 | LCD.33 31.65,16.28 40.26,24.89 | 40.26,24.89 40.39,25.02 | 40.39,25.02 40.51,25.15 | 40.51,25.15 41.02,25.65 41.02,25.91 v40.64,25.91 | 40.26,24.89 40.26,26.16 | 40.39,25.02 40.39,25.91 | 40.51,25.15 40.51,25.91
  Bottom 0.61: LCD_LIME.30 68.33,31.37 v67.82,31.88
  Bottom 1.016: v40.64,25.91 LCD_CON.30
N$1  (via drill 0.6)
  Top 1.016: v49.15,11.94 52.07,11.94 53.47,10.54 v55.24,10.54
  Bottom 0.762: v55.24,10.54 55.37,10.67 5.0V/3.3V.3
  Bottom 1.016: FET1.3 48.43,11.94 v49.15,11.94
N$2
  Bottom 1.016: T2.3 6.86,6.1 7.81,5.15 T1.1
N$4  (via drill 0.6)
  Top 0.254: v44.7,32 46.61,33.91 64.9,33.91 v65.79,33.02 66.42,32.38 66.42,30.35 64.26,28.19 v64.26,25.15
  Bottom 0.406: v65.79,33.02 LCD_LIME.33 | v64.26,25.15 65.79,23.62 LCD_LIME2.33
  Bottom 1.016: LCD_CON.33 45.72,33.02 v44.7,32
N$6  (via drill 0.6)
  Top 0.254: v45.72,25.91 46.1,25.53 61.72,25.53 63.75,27.56 63.75,28.45 65.53,30.23 v65.53,31.75
  Bottom 0.254: LCD_LIME2.34 65.79,27.56 65.15,28.19 65.15,28.96 65.79,29.59 LCD_LIME.34
  Bottom 0.61: v65.53,31.75 65.79,31.5 LCD_LIME.34
  Bottom 1.016: v45.72,25.91 LCD_CON.34
N$8
  Bottom 0.254: R4.1 52.58,18.67 52.58,20.32 52.32,20.57 49.78,20.57
  Bottom 1.016: FET2.1 51.69,14.62 C2.2 R4.1 | 49.78,20.57 48.96,19.75 D1.1
N$9
  Bottom 1.016: FET1.1 47.12,14.56 C1.2 R3.1 47.12,19.41 D1.2
N$10  (via drill 0.6)
  Top 1.016: v4.83,32.13 4.83,31.24 5.84,30.23 13.84,30.23 23.75,20.32 52.96,20.32 57.66,15.62 82.3,15.62 v84.96,18.29
  Bottom 0.762: 86.23,34.29 LCD_LIME.1 | 86.23,22.86 LCD_LIME2.1 | 81.79,15.75 5V_JACK/5V_LCD_CON.3
  Bottom 1.016: v4.83,32.13 4.83,32.64 5.08,32.89 LCD_CON.1 | 81.79,15.75 81.79,16.64 83.44,18.29 v84.96,18.29 87.5,20.83 87.5,22.86 | 86.23,34.29 87.5,33.02 87.5,22.86 | 87.5,22.86 86.23,22.86
N$11
  Bottom 1.016: T3.3 52.56,21.99 R6.1
N$16
  Bottom 0.762: CTRL/EN.2 54.1,20.32 53.51,19.73 T3.1
N$19
  Bottom 1.016: D1.3 48.01,21.97 R6.2
N$22
  Bottom 0.762: 84.33,15.75 5V_JACK/5V_LCD_CON.1
  Bottom 1.016: PWR_JACK.1 86.36,12 86.36,13.72 84.33,15.75
N$31
  Bottom 0.61: U1.5 12.32,21.59 12.32,21.84
  Bottom 1.016: R10.1 R11.2 12.32,21.84
N$64  (via drill 0.6)
  Top 1.016: v4.83,20.32 4.83,23.11 v4.32,23.62
  Bottom 0.61: v4.83,20.32 U1.3
  Bottom 1.016: v4.32,23.62 C6.1
N$65
  Bottom 0.61: U1.1 6.6,17.78 6.6,17.4
  Bottom 1.27: D2.A 3.4,10.51 4.37,11.48 L1.1 4.37,15.16 6.6,17.4
N$74
  Bottom 0.61: U1.7 14.48,19.05 15.24,19.81 R8.2
  Bottom 1.016: R8.2 17.4,19.56 R9.2 | U1.7 11.05,19.05 10.54,18.54 10.54,12.32 L1.2
N$81
  Bottom 0.61: U1.8 15.37,17.78 R9.1
TPX1  (via drill 0.6)
  Top 0.254: v49.66,29.97 49.78,30.1 53.21,30.1 54.1,30.99 60.07,30.99 v60.45,30.61
  Bottom 0.203: 61.27,31.42 61.29,31.45 62.66,31.45 62.69,31.42
  Bottom 0.254: R2.2 46.61,8.64 35.18,8.64 33.65,10.17 LCD.37 33.65,13.96 34.29,14.61 36.58,14.61 48.01,26.04 49.02,26.04 49.66,26.67 v49.66,29.97 | LCD_LIME.38 63.25,30.86 62.69,31.42 | v60.45,30.61 61.27,31.42
  Bottom 0.508: LCD_LIME.38 LCD_LIME2.38
  Bottom 1.016: v49.66,29.97 50.8,29.97 LCD_CON.38
TPX2  (via drill 0.6)
  Top 0.254: v55.88,32.51 55.5,32.89 50.16,32.89 v49.78,32.51 48.9,32.51 48.26,31.88 48.26,29.97 49.15,29.08 51.94,29.08 v52.07,29.21
  Bottom 0.203: 61.72,33.02 61.77,33.07 62.66,33.07 62.69,33.1 | 61.85,24.13 61.9,24.08 62.66,24.08 62.69,24.05
  Bottom 0.254: LCD.39 34.65,13.95 34.8,14.1 36.83,14.1 48.26,25.53 50.93,25.53 52.07,26.67 v52.07,29.21 | 61.72,33.02 56.39,33.02 v55.88,32.51 55.88,24.77 56.52,24.13 61.85,24.13 | 62.69,33.1 63.25,33.66 LCD_LIME.37 | LCD_LIME2.37 63.25,23.5 62.69,24.05
  Bottom 1.016: LCD_CON.37 50.8,32.51 v49.78,32.51
TPY1
  Bottom 0.254: 34.15,11.94 34.15,10.43 35.43,9.14 44.7,9.14 46.23,10.67 | 34.15,11.94 LCD.38 | 55.37,24.51 56.26,23.62 61.98,23.62 LCD_LIME2.39 | 55.37,24.51 55.37,31.62 54.48,32.51 55.5,33.53 61.98,33.53 LCD_LIME.39 61.98,34.42 | 34.15,11.94 35.43,11.94 35.69,12.19 35.69,12.7 36.07,13.08 37.34,13.08 48.77,24.51 55.37,24.51
  Bottom 1.016: LCD_CON.39 53.34,32.51 54.48,32.51 | 46.23,10.67 R1.2
TPY2  (via drill 0.6)
  Top 0.254: v54.48,30.1 v59.31,30.1
  Bottom 0.254: LCD.40 35.15,13.56 35.18,13.59 37.08,13.59 48.51,25.02 51.18,25.02 53.34,27.18 LCD_CON.40 | v59.31,30.1 59.69,29.72 61.98,29.72 LCD_LIME.40
  Bottom 0.508: 61.98,29.72 LCD_LIME2.40
  Bottom 1.016: v54.48,30.1 53.34,30.1 LCD_CON.40
VCC  (via drill 0.6)
  Top 1.016: v51.44,10.67 v30.73,10.67 29.34,10.67 24.77,6.1 4.57,6.1 v2.41,8.26 2.41,17.53 3.05,18.16 10.67,18.16 v12.32,16.51
  Bottom 0.254: C3.1 17.15,15.62 LCD.4 | T2.1 4.12,5.15 3.17,6.1 1.65,6.1 1.4,6.35 1.4,7.62 2.03,8.26 v2.41,8.26 | LCD.31 30.65,10.75 v30.73,10.67
  Bottom 0.508: C3.1 17.4,16.13 16.64,16.89 13.46,16.89 13.08,16.51
  Bottom 0.762: FET2.3 52.58,12.7 52.83,12.95 5.0V/3.3V.1
  Bottom 1.016: v12.32,16.51 13.08,16.51 | v51.44,10.67 R5.2 R2.1 R1.1 v51.44,10.67 | v51.44,10.67 52.58,11.81 FET2.3
VLED+
  Bottom 0.254: LCD.2 16.15,12.21 15.37,11.43 15.37,6.48 14.99,6.1
  Bottom 1.016: T1.3 14.99,6.1

### Text on the board
Top: Da se iztrie pechata na C5 kudeto zastupva R9 i C3 | Total Errors: 27
bNames: 1 | 2 | https://www.olimex.com | + | RoHS Compliant | 5VDC only!!! | LCD-OLINUXINO-4.3''TS | (C) 2019 | Rev.D